# Altium schematic sheet schematic.schdoc
size 227 x 181 mm
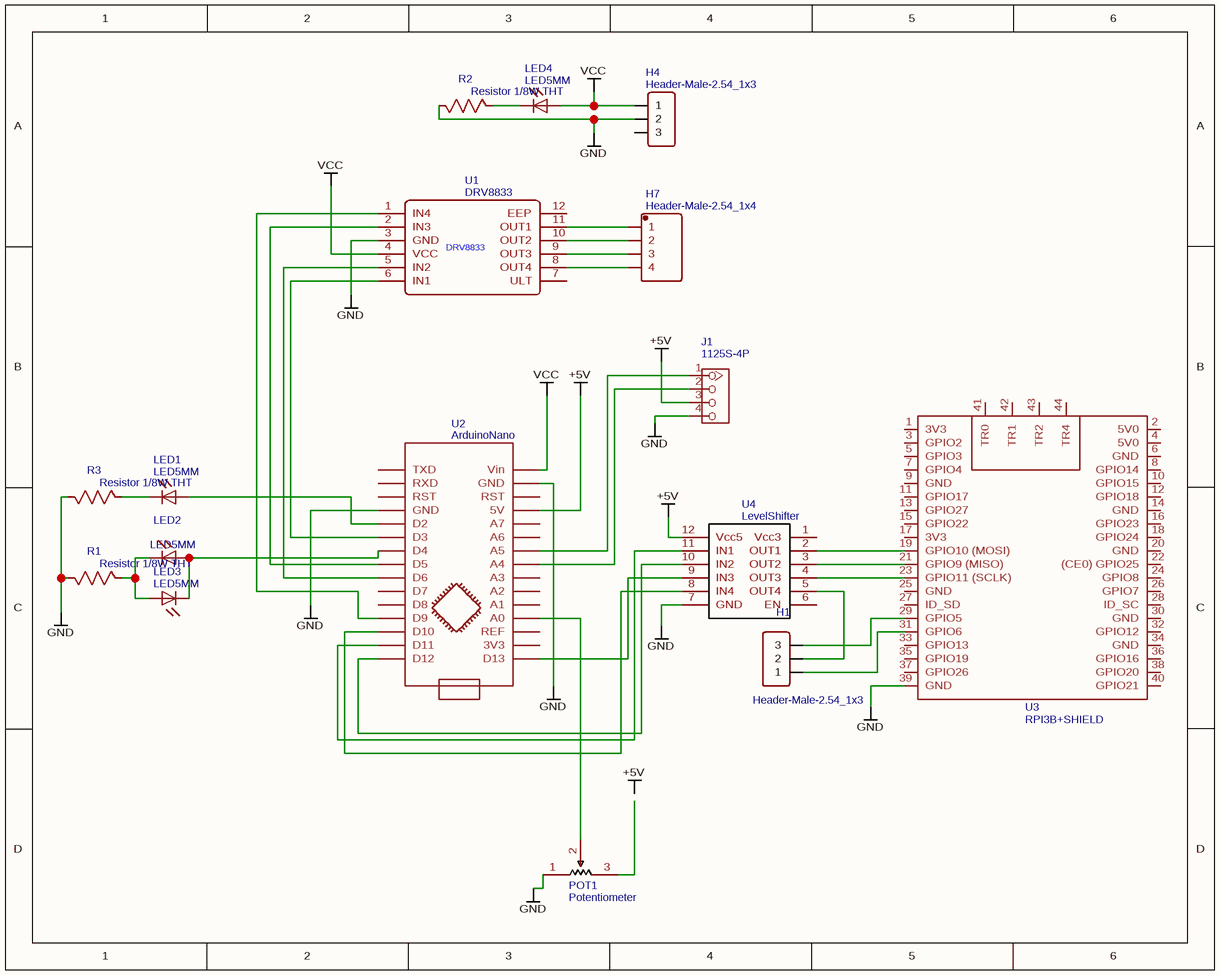
[diagram p0: schematic.schdoc]

## Parts
H1  Header-Male-2.54_1x3  [HDR-TH_3P-P2.54-V]
H4  Header-Male-2.54_1x3  [HDR-TH_3P-P2.54-V]
H7  Header-Male-2.54_1x4  [HDR-TH_4P-P2.54-V]
J1  1125S-4P  [HW4-2.0]
LED1  LED5MM  [LED5MM]
LED2  LED5MM  [LED5MM]
LED3  LED5MM  [LED5MM]
LED4  LED5MM  [LED5MM]
POT1  Potentiometer  [MY_POT]
R1  Resistor 1/8W THT  [RESISTOR 1/8W THT]
R2  Resistor 1/8W THT  [RESISTOR 1/8W THT]
R3  Resistor 1/8W THT  [RESISTOR 1/8W THT]
U1  DRV8833  [DRV8833 MOTOR DRIVER]
U2  ArduinoNano  [ARDUINO NANO VINCENT]
U3  RPI3B+SHIELD  [RPI3B+SHIELD]
U4  LevelShifter  [12PIN]

## Nets
+5V: J1.3 U2.27(5V) U4.12(Vcc5)
GND: H4.2 J1.4 POT1.1 R1.2 R2.2 R3.2 U1.3(GND) U2.4(GND) U2.29(GND) U3.39(GND) U4.7(GND)
VCC: H4.1 LED4.A U1.4(VCC) U2.30(Vin)
NetH1_1: H1.1 U3.31(GPIO6)
NetH1_2: H1.2 U4.5(OUT4)
NetH1_3: H1.3 U3.29(GPIO5)
NetH7_1: H7.1 U1.11(OUT1)
NetH7_2: H7.2 U1.10(OUT2)
NetH7_3: H7.3 U1.9(OUT3)
NetH7_4: H7.4 U1.8(OUT4)
NetJ1_1: J1.1 U2.24(A5)
NetJ1_2: J1.2 U2.23(A4)
NetLED1_A: LED1.A U2.5(D2)
NetLED1_K: LED1.K(C) R3.1
NetLED2_A: LED2.A LED3.K(C) U2.7(D4)
NetLED2_K: LED2.K(C) LED3.A R1.1
NetLED4_K: LED4.K(C) R2.1
NetPOT1_2: POT1.2 U2.19(A0)
NetU1_1: U1.1(IN4) U2.12(D9)
NetU1_2: U1.2(IN3) U2.8(D5)
NetU1_5: U1.5(IN2) U2.9(D6)
NetU1_6: U1.6(IN1) U2.6(D3)
NetU2_13: U2.13(D10) U4.8(IN4)
NetU2_14: U2.14(D11) U4.11(IN1)
NetU2_15: U2.15(D12) U4.10(IN2)
NetU2_16: U2.16(D13) U4.9(IN3)
NetU3_19: U3.19(GPIO10_(MOSI)) U4.2(OUT1)
NetU3_21: U3.21(GPIO9_(MISO)) U4.3(OUT2)
NetU3_23: U3.23(GPIO11_(SCLK)) U4.4(OUT3)

Not connected (* = marked no-connect by the designer): H4 3; POT1 3; U1 7(ULT) 12(EEP); U2 1(TXD) 2(RXD) 3(RST) 10(D7) 11(D8) 17(3V3) 18(REF) 20(A1) 21(A2) 22(A3) 25(A6) 26(A7) 28(RST); U3 1(3V3) 2(5V0) 3(GPIO2) 4(5V0) 5(GPIO3) 6(GND) 7(GPIO4) 8(GPIO14) 9(GND) 10(GPIO15) 11(GPIO17) 12(GPIO18) 13(GPIO27) 14(GND) 15(GPIO22) 16(GPIO23) 17(3V3) 18(GPIO24) 20(GND) 22((CE0)_GPIO25) 24(GPIO8) 25(GND) 26(GPIO7) 27(ID_SD) 28(ID_SC) 30(GND) 32(GPIO12) 33(GPIO13) 34(GND) 35(GPIO19) 36(GPIO16) 37(GPIO26) 38(GPIO20) 40(GPIO21) 41(TR0) 42(TR1) 43(TR2) 44(TR4); U4 1(Vcc3) 6(EN)

## Notes on the sheet
- Labels drawn without touching a wire or pin: +5V

## Library data of the parts
H1 H4 = Header-Male-2.54_1x3: BOM_Manufacturer: BOOMELE; BOM_Manufacturer Part: Header2.54mm 1*3P; BOM_Supplier: LCSC; image: //image.lceda.cn/szlcsc/C49257.jpg; BOM_Supplier Part: C49257; spicePre: H; spiceSymbolName: Header-Male-2.54_1x3
H7 = Header-Male-2.54_1x4: BOM_Manufacturer: Ckmtw; BOM_Manufacturer Part: 210S-1*4P L=11.6MMGold-plated black; Contributor: LCSC; BOM_Supplier: LCSC; BOM_Supplier Part: C124378; spicePre: H; spiceSymbolName: Header-Male-2.54_1x4
J1 = 1125S-4P: description: DIP Grove; BOM_Manufacturer Part: 1125S-4P; spicePre: J; spiceSymbolName: 1125S-4P
LED1-LED4 = LED5MM: description: LEDs; Contributor: Pinoccio; spicePre: L; spiceSymbolName: LED5MM
POT1 = Potentiometer: Contributor: Tommaso Mariotti; BOM_Manufacturer Part: potentiometer; spicePre: p; spiceSymbolName: Potentiometer
R1-R3 = Resistor 1/8W THT: BOM_Manufacturer: Generic; Contributor: tyvogelpohl; BOM_Manufacturer Part: Generic; BOM_Supplier: Mouser; BOM_Supplier Part: Generic; spicePre: R; spiceSymbolName: Resistor 1/8W THT
U1 = DRV8833: sourceId: YsmgyP7pj; timeStamp: 1453691553; spicePre: U; spiceSymbolName: DRV8833
U2 = ArduinoNano: Contributor: vincint810923; BOM_Manufacturer Part: ArduinoNano; spicePre: U; spiceSymbolName: ArduinoNano
U3 = RPI3B+SHIELD: BOM_Manufacturer Part: RaspberryPi 3; Contributor: gdevries; spicePre: U; spiceSymbolName: RPI3B+SHIELD
U4 = LevelShifter: Contributor: max.helmrich; spicePre: U; spiceSymbolName: LevelShifter